# EAGLE schematic w (EAGLE 7.1.0)
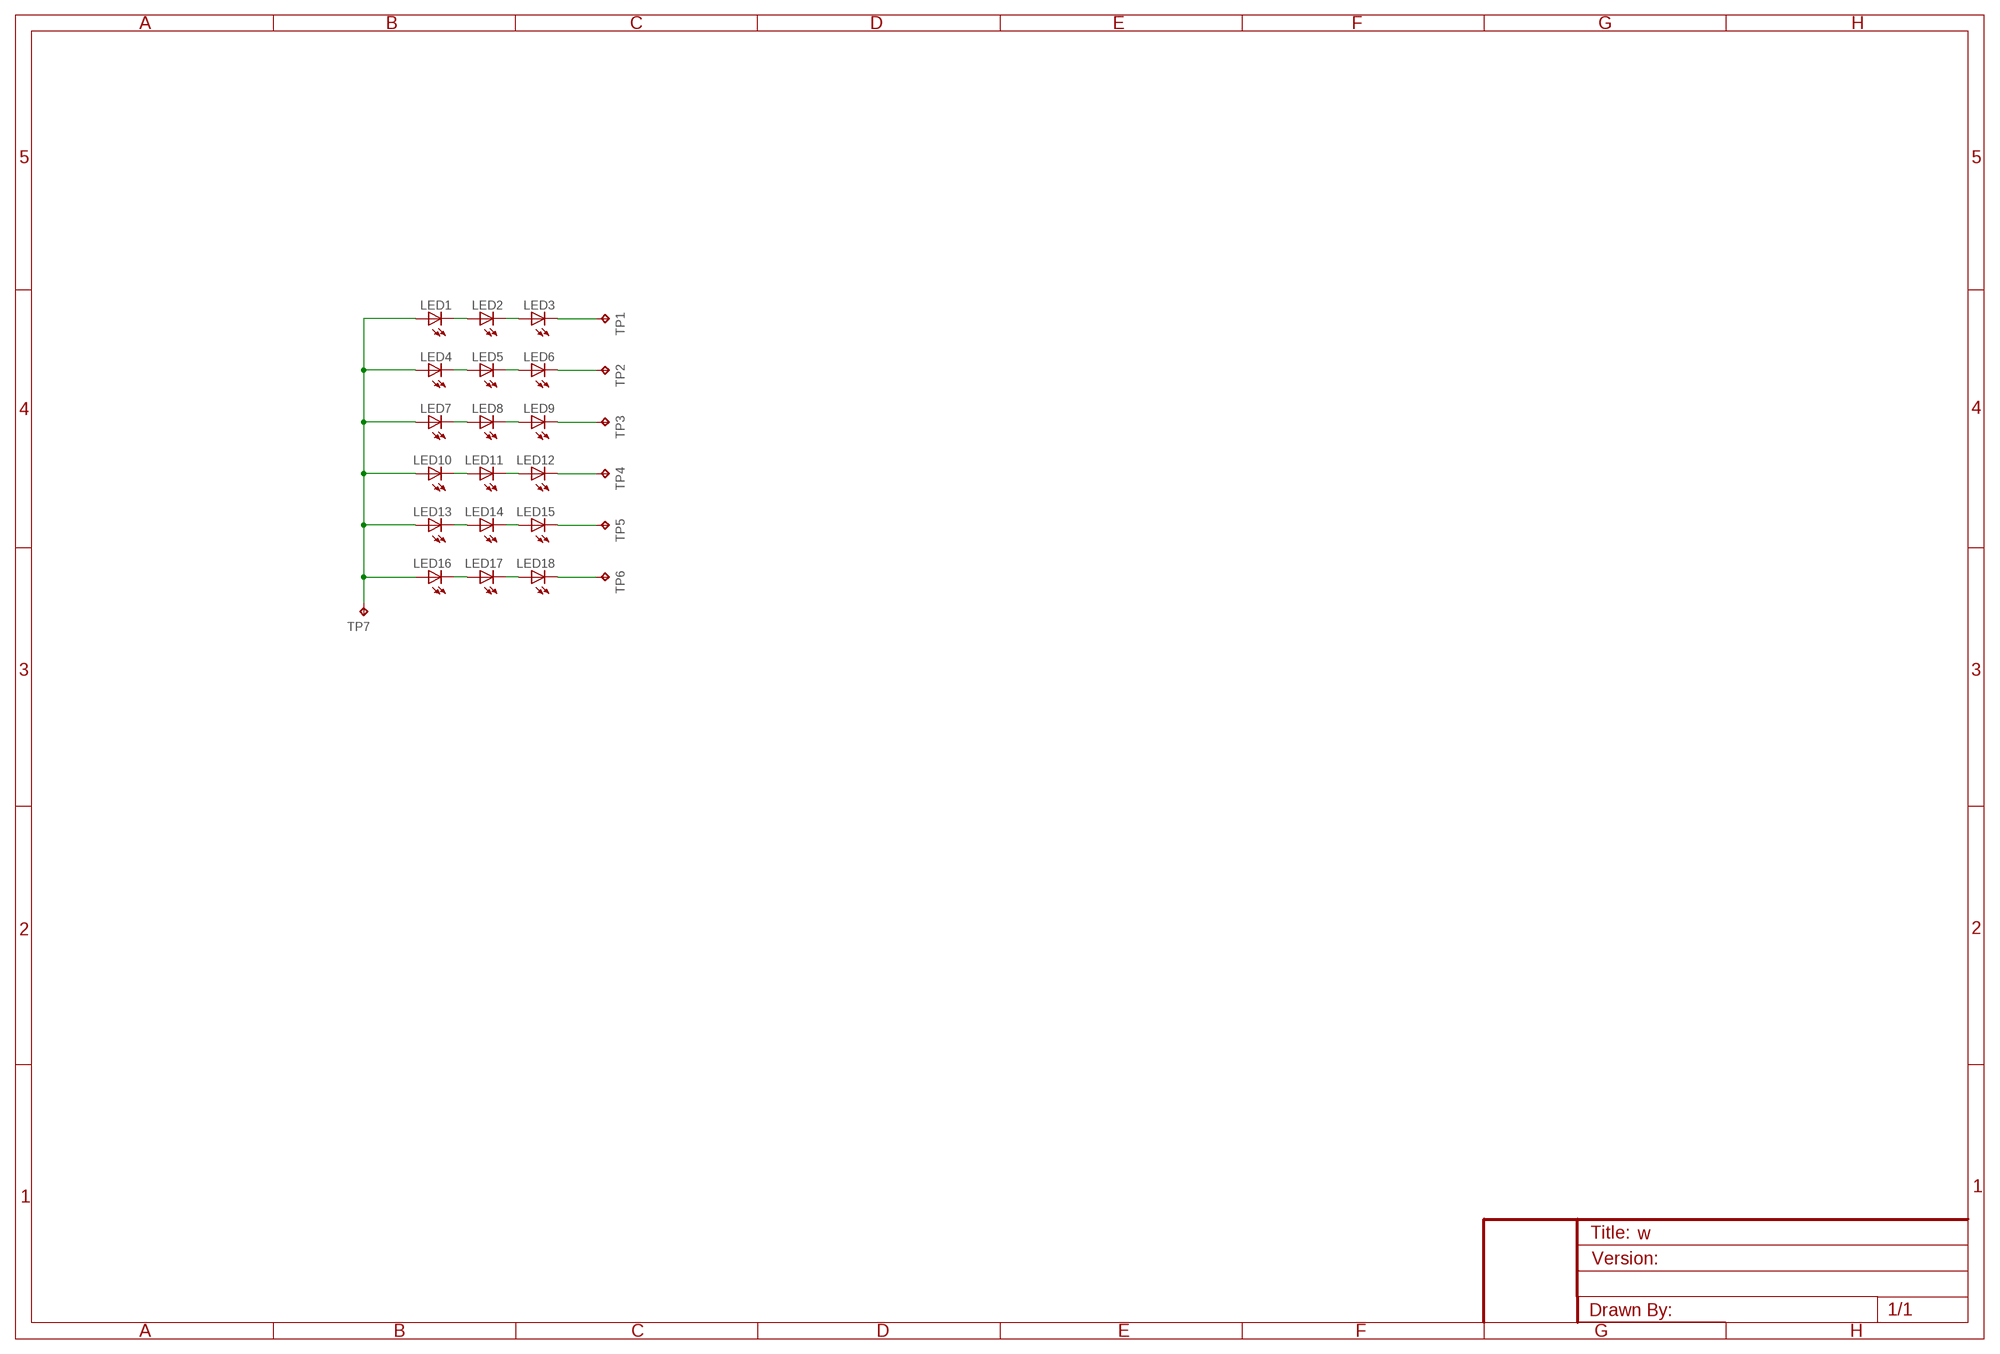
[diagram p0: schematic, sheet 1]

## Parts
LED1  LED0805  [LED_0805]
LED2  LED0805  [LED_0805]
LED3  LED0805  [LED_0805]
LED4  LED0805  [LED_0805]
LED5  LED0805  [LED_0805]
LED6  LED0805  [LED_0805]
LED7  LED0805  [LED_0805]
LED8  LED0805  [LED_0805]
LED9  LED0805  [LED_0805]
LED10  LED0805  [LED_0805]
LED11  LED0805  [LED_0805]
LED12  LED0805  [LED_0805]
LED13  LED0805  [LED_0805]
LED14  LED0805  [LED_0805]
LED15  LED0805  [LED_0805]
LED16  LED0805  [LED_0805]
LED17  LED0805  [LED_0805]
LED18  LED0805  [LED_0805]
TP1  TEST_POINTPAD1-20  [P1-20]
TP2  TEST_POINTPAD1-20  [P1-20]
TP3  TEST_POINTPAD1-20  [P1-20]
TP4  TEST_POINTPAD1-20  [P1-20]
TP5  TEST_POINTPAD1-20  [P1-20]
TP6  TEST_POINTPAD1-20  [P1-20]
TP7  TEST_POINTPAD1-20  [P1-20]

## Nets
N$25: LED2.C LED3.A
N$26: LED1.C LED2.A
N$29: LED5.C LED6.A
N$30: LED4.C LED5.A
N$31: LED8.C LED9.A
N$32: LED7.C LED8.A
N$33: LED11.C LED12.A
N$34: LED10.C LED11.A
N$35: LED14.C LED15.A
N$36: LED13.C LED14.A
N$37: LED17.C LED18.A
N$38: LED16.C LED17.A
VIN3: LED1.A LED4.A LED7.A LED10.A LED13.A LED16.A TP7.TP
VOUT14: LED3.C TP1.TP
VOUT15: LED6.C TP2.TP
VOUT16: LED9.C TP3.TP
VOUT17: LED12.C TP4.TP
VOUT18: LED15.C TP5.TP
VOUT19: LED18.C TP6.TP

## Library data of the parts
LED1-LED18 = CyberRailGuru:LED: LEDs Standard schematic elements and footprints for 5mm, 3mm, 1206, and 0603 sized LEDs. 5mm - Spark Fun Electronics SKU : COM-00529 (and others)
TP1-TP7 = CyberRailGuru:TEST_POINT: Test pad